# EAGLE board SparkFun_Main_Board_Double_v20 (EAGLE 9.6.2)
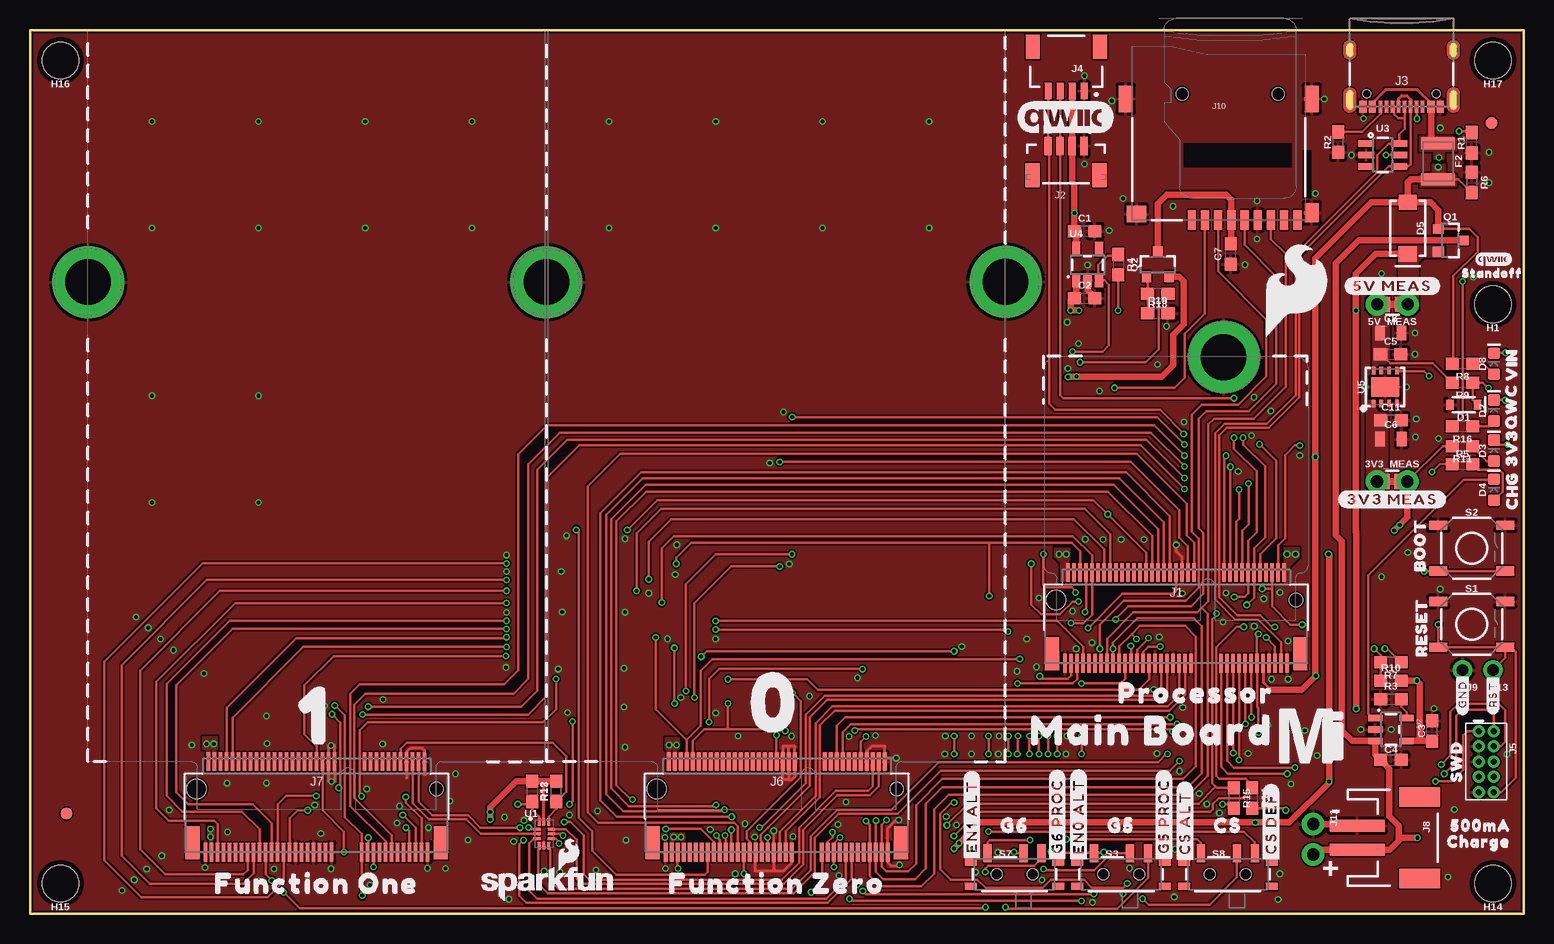
[diagram p1: board, top side]
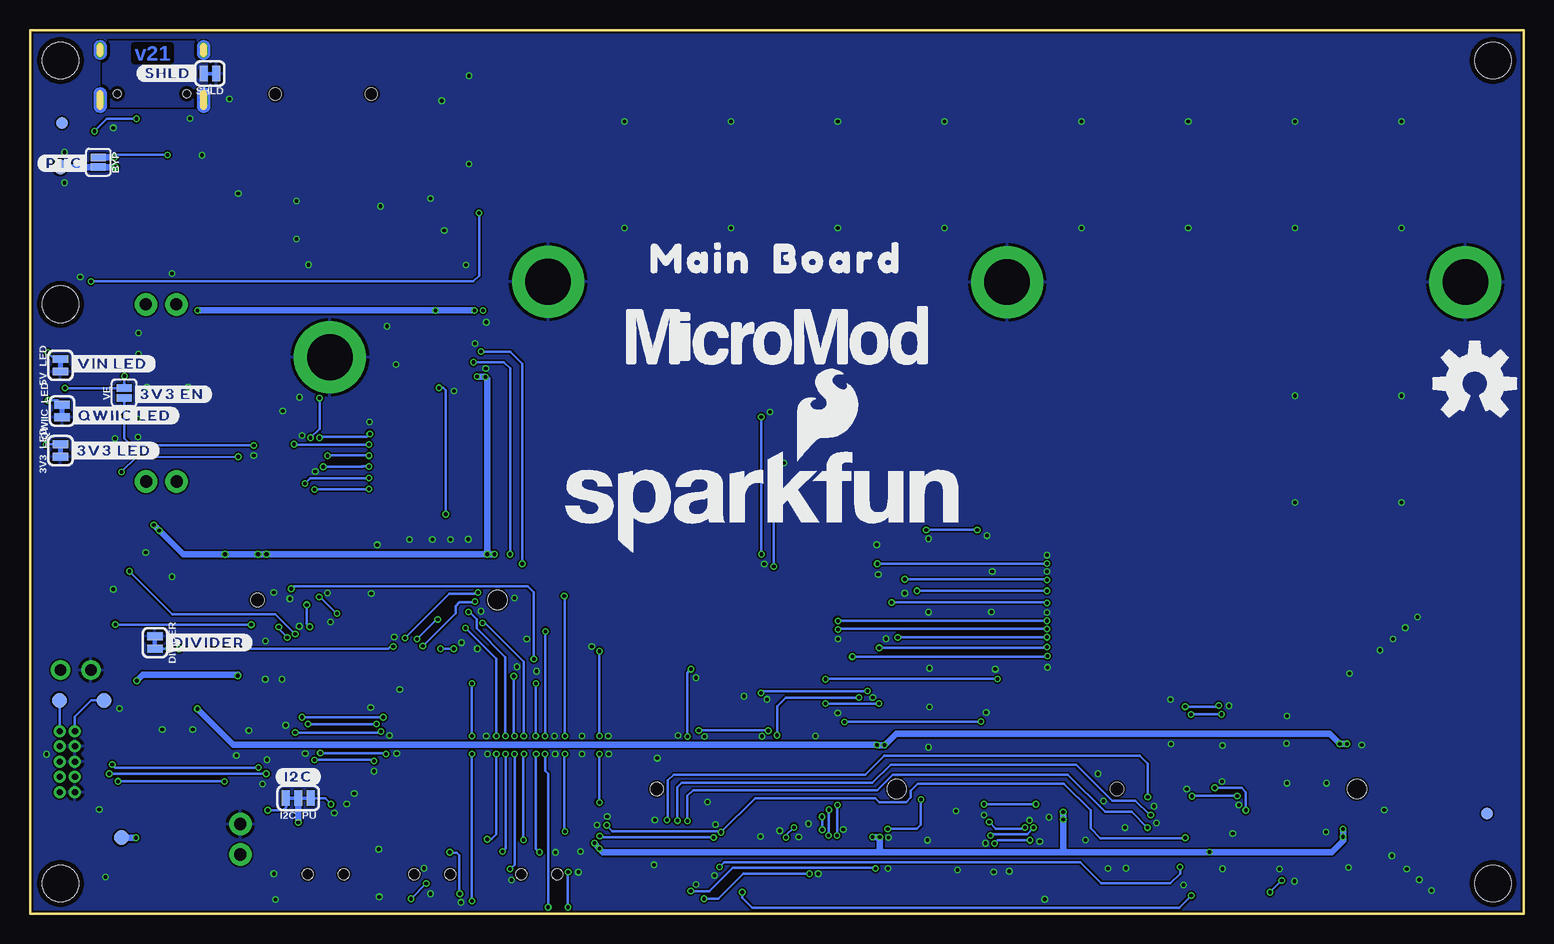
[diagram p2: board, bottom side, seen from below]

Size 124.46 x 73.66 mm. Coordinates in mm from the lower left corner, seen from the top.
Outline: 0,73.66 124.46,73.66 124.46,0 0,0 0,73.66
Copper layers (1*16): Top 0.035mm / dielectric 1.5mm / Bottom 0.035mm
Design rules "SparkFun-2-Layer-Minimum-JLCPCB": minimum track width 5mil, minimum drill 0.3mm, track to track 5mil, track to pad 5mil, pad to pad 5mil, via to via 5mil, smd to smd 5mil, copper to edge 7mil, drill to drill 7mil, minimum pad ring 5mil, minimum via ring 5mil, stop-mask expansion 2.5mil, vias tented up to drill 25mil, thermal gap 10mil
Net classes: 0 default: width 0.178 mm, drill 0.305 mm; 1 POWER: width 0.559 mm, drill 0.305 mm; 2 Diff pairs: width 0.203 mm, drill 0.305 mm
tRestrict: area 25.1,12.5 to 25.2,12.9; area 25.6,12.5 to 25.7,12.9; area 62.9,12.5 to 63,12.9; area 63.4,12.5 to 63.6,12.9

## Footprints (pad centres in the part's own frame; a part is rotated, then mirrored left to right if it is on the bottom)
SMT-JUMPER_2_NC_TRACE_SILK = smd 0.66 x 1.27: 1 -0.521,0; 2 0.521,0
COMBO-JUMPER_2_NC_TRACE = smd 0.635 x 1.27: 1 -0.508,0; 2 0.508,0 | drill 1.016 pad 1.88: 3 -1.27,0; 4 1.27,0
SMT-JUMPER_2_NO_SILK = smd 0.635 x 1.27: 1 -0.406,0; 2 0.406,0
0603 = smd 1.1 x 1: 1 -0.85,0; 2 0.85,0
0805 = smd 0.8 x 1.2: 1 -0.9,0; 2 0.9,0
SOD-323 = smd 0.63 x 0.83: A 1.15,0; C -1.15,0
LED-0603 = smd 1 x 1: A -0.877,0; C 0.877,0
SMA-DIODE = smd 1.27 x 1.47: A -2.15,0; C 2.15,0
1210 = smd 1 x 2.8: 1 -1.5,0; 2 1.5,0
FIDUCIAL-1X2 = smd 1 x 1: 1 0,0
STAND-OFF-TIGHT = hole 3.048: 0,0
STAND-OFF-REFLOW-M2.5 = drill 3.8 pad 6: 1 0,0
SMT-JUMPER_3_2-NC_TRACE_SILK = smd 0.66 x 1.27: 1 -1.041,0; 2 0,0; 3 1.041,0
M.2-CONNECTOR-E = smd 0.3 x 1.55: 1 9.25,-5.275; 2 9,2.275; 3 8.75,-5.275; 4 8.5,2.275; 5 8.25,-5.275; 6 8,2.275; 7 7.75,-5.275; 8 7.5,2.275; 9 7.25,-5.275; 10 7,2.275; 11 6.75,-5.275; 12 6.5,2.275; 13 6.25,-5.275; 14 6,2.275; 15 5.75,-5.275; 16 5.5,2.275; 17 5.25,-5.275; 18 5,2.275; 19 4.75,-5.275; 20 4.5,2.275; 21 4.25,-5.275; 22 4,2.275; 23 3.75,-5.275; 32 1.5,2.275; 33 1.25,-5.275; 34 1,2.275; 35 0.75,-5.275; 36 0.5,2.275; 37 0.25,-5.275; 38 0,2.275; 39 -0.25,-5.275; 40 -0.5,2.275; 41 -0.75,-5.275; 42 -1,2.275; 43 -1.25,-5.275; 44 -1.5,2.275; 45 -1.75,-5.275; 46 -2,2.275; 47 -2.25,-5.275; 48 -2.5,2.275; 49 -2.75,-5.275; 50 -3,2.275; 51 -3.25,-5.275; 52 -3.5,2.275; 53 -3.75,-5.275; 54 -4,2.275; 55 -4.25,-5.275; 56 -4.5,2.275; 57 -4.75,-5.275; 58 -5,2.275; 59 -5.25,-5.275; 60 -5.5,2.275; 61 -5.75,-5.275; 62 -6,2.275; 63 -6.25,-5.275; 64 -6.5,2.275; 65 -6.75,-5.275; 66 -7,2.275; 67 -7.25,-5.275; 68 -7.5,2.275; 69 -7.75,-5.275; 70 -8,2.275; 71 -8.25,-5.275; 72 -8.5,2.275; 73 -8.75,-5.275; 74 -9,2.275; 75 -9.25,-5.275 | smd 1.2 x 2.75: A1 10.35,-4.5; A2 -10.35,-4.5 | hole 1.1: 10,0 | hole 1.6: -10,0
JST04_1MM_VERT = smd 0.6 x 1.55: 1 -1.478,0.775; 2 -0.478,0.775; 3 0.522,0.775; 4 1.522,0.775 | smd 1.2 x 2: NC1 -2.778,3.2; NC2 2.822,3.2
USB-C-16P-2LAYER-PADS = smd 0.3 x 1: A5 -1.25,-0.34; A6 -0.25,-0.34; A7 0.25,-0.34; A8 1.25,-0.34; B5 1.75,-0.34; B6 0.75,-0.34; B7 -0.75,-0.34; B8 -1.75,-0.34 | smd 0.6 x 1: GND -3.225,-0.34; GND2 3.225,-0.34; VBUS1 -2.45,-0.34; VBUS2 2.45,-0.34 | drill 0.4 pad 0.6 long: SHLD1 -4.318,-0.915; SHLD2 4.318,-0.915; SHLD3 -4.318,-5.095; SHLD4 4.318,-5.095 | hole 0.65: -2.89,-1.445; 2.89,-1.445
JST04_1MM_RA = smd 0.6 x 1.35: 1 -1.5,0; 2 -0.5,0; 3 0.5,0; 4 1.5,0 | smd 1.2 x 2: NC1 2.8,-3.675; NC2 -2.8,-3.675
2X5-PTH-1.27MM = drill 0.508 pad 1: 1 -2.54,-0.635; 2 -2.54,0.635; 3 -1.27,-0.635; 4 -1.27,0.635; 5 0,-0.635; 6 0,0.635; 7 1.27,-0.635; 8 1.27,0.635; 9 2.54,-0.635; 10 2.54,0.635
M.2-CONNECTOR-E-FUNCTION-STANDARD = smd 0.3 x 1.55: 1 9.25,-5.275; 2 9,2.275; 3 8.75,-5.275; 4 8.5,2.275; 5 8.25,-5.275; 6 8,2.275; 7 7.75,-5.275; 8 7.5,2.275; 9 7.25,-5.275; 10 7,2.275; 11 6.75,-5.275; 12 6.5,2.275; 13 6.25,-5.275; 14 6,2.275; 15 5.75,-5.275; 16 5.5,2.275; 17 5.25,-5.275; 18 5,2.275; 19 4.75,-5.275; 20 4.5,2.275; 21 4.25,-5.275; 22 4,2.275; 23 3.75,-5.275; 32 1.5,2.275; 33 1.25,-5.275; 34 1,2.275; 35 0.75,-5.275; 36 0.5,2.275; 37 0.25,-5.275; 38 0,2.275; 39 -0.25,-5.275; 40 -0.5,2.275; 41 -0.75,-5.275; 42 -1,2.275; 43 -1.25,-5.275; 44 -1.5,2.275; 45 -1.75,-5.275; 46 -2,2.275; 47 -2.25,-5.275; 48 -2.5,2.275; 49 -2.75,-5.275; 50 -3,2.275; 51 -3.25,-5.275; 52 -3.5,2.275; 53 -3.75,-5.275; 54 -4,2.275; 55 -4.25,-5.275; 56 -4.5,2.275; 57 -4.75,-5.275; 58 -5,2.275; 59 -5.25,-5.275; 60 -5.5,2.275; 61 -5.75,-5.275; 62 -6,2.275; 63 -6.25,-5.275; 64 -6.5,2.275; 65 -6.75,-5.275; 66 -7,2.275; 67 -7.25,-5.275; 68 -7.5,2.275; 69 -7.75,-5.275; 70 -8,2.275; 71 -8.25,-5.275; 72 -8.5,2.275; 73 -8.75,-5.275; 74 -9,2.275; 75 -9.25,-5.275 | smd 1.2 x 2.75: A1 10.35,-4.5; A2 -10.35,-4.5 | hole 1.1: 10,0 | hole 1.6: -10,0
JST-2-SMD = smd 1 x 4.6: 1 -1,-3.7; 2 1,-3.7 | smd 1.6 x 3.4: NC1 -3.4,1.5; NC2 3.4,1.5
1X01_NO_SILK = drill 0.95 pad 1.6: 1 0,0
MICROSD-EXTERNALPIN = smd 0.7 x 1.6: 1 2.25,10.5; 2 1.15,10.5; 3 0.05,10.5; 4 -1.05,10.5; 5 -2.15,10.5; 6 -3.25,10.5; 7 -4.35,10.5; 8 -5.45,10.5; 9 -6.55,10.5 | smd 1.2 x 1.6: 10 -7.75,9.9 | smd 1.2 x 2.2: 11 -7.75,0.4; 12 7.75,0.4 | smd 1.6 x 1.4: 13 6.85,10 | hole 1: 3.05,0; -4.95,0
1X02_NO_SILK = drill 1.016 pad 1.88: 1 0,0; 2 2.54,0
SOT23-3 = smd 0.8 x 0.9: 1 -0.95,-1; 2 0.95,-1; 3 0,1.1
TACTILE_SWITCH_SMD_5.2MM = smd 1.524 x 0.762: 1 -2.794,1.905; 2 2.794,1.905; 3 -2.794,-1.905; 4 2.794,-1.905
SWITCH_SPST_SMD_A = smd 0.7 x 1.5: 1 -2.25,-1.75; 2 -0.75,-1.75; 3 2.25,-1.75 | smd 1 x 0.6: GND1 -3.65,1; GND3 3.65,1 | smd 1 x 0.8: GND2 -3.65,-1.1; GND4 3.65,-1.1 | hole 0.9: -1.5,0; 1.5,0
PAD.03X.05 = smd 1.27 x 1.27: 1 0,0
STG3856 = smd 0.6 x 0.25: P1 -0.59,0.41; P2 -0.59,0.01; P3 -0.59,-0.39; P7 0.58,-0.39; P8 0.58,0.01; P9 0.58,0.41 | smd 0.25 x 0.6: P4 -0.42,-0.96; P5 -0.02,-0.96; P6 0.38,-0.96; P10 0.38,1.01; P11 -0.02,1.01; P12 -0.42,1.01
SOT23-5 = smd 0.55 x 1.2: 1 -0.95,-1.3; 2 0,-1.3; 3 0.95,-1.3; 4 0.95,1.3; 5 -0.95,1.3
SOT-23-6 = smd 0.55 x 1.35: 1 -0.95,-1.375; 2 0,-1.375; 3 0.95,-1.375; 4 0.95,1.375; 5 0,1.375; 6 -0.95,1.375
SOT25 = smd 0.7 x 1.2: 1 -0.95,-1.3; 2 0,-1.3; 3 0.95,-1.3; 4 0.95,1.3; 5 -0.95,1.3
UDFN-8 = smd 0.3 x 0.65: 1 -0.975,-1.375; 2 -0.325,-1.375; 3 0.325,-1.375; 4 0.975,-1.375; 5 0.975,1.375; 6 0.325,1.375; 7 -0.325,1.375; 8 -0.975,1.375 | smd 2.35 x 1.6: EP 0,0

## Placement (x,y rotation side)
3V3_LED  JUMPER-SMT_2_NC_TRACE_SILK  [SMT-JUMPER_2_NC_TRACE_SILK]  121.92,38.61 90 bottom
3V3_MEAS  JUMPER-COMBO_2_NC_TRACE  [COMBO-JUMPER_2_NC_TRACE]  113.51,36.04 0 top
5V_LED  JUMPER-SMT_2_NC_TRACE_SILK  [SMT-JUMPER_2_NC_TRACE_SILK]  121.92,45.72 90 bottom
5V_MEAS  JUMPER-COMBO_2_NC_TRACE  [COMBO-JUMPER_2_NC_TRACE]  113.54,50.8 180 top
BYP  JUMPER-SMT_2_NO_SILK  [SMT-JUMPER_2_NO_SILK]  118.77,62.64 270 bottom
C1  1.0uF  [0603]  87.88,56.9 0 top
C2  1.0uF  [0603]  87.88,51.31 0 top
C3  4.7uF  [0603]  116.84,15.24 90 top
C4  4.7uF  [0603]  113.41,12.83 0 top
C5  0.1uF  [0603]  113.39,46.63 0 top
C6  10uF  [0805]  113.41,39.57 0 top
C7  10uF  [0603]  100.08,54.99 90 top
C8  10uF  [0805]  113.39,48.41 0 top
C11  4.7uF  [0603]  113.41,41.15 0 top
D1  3.3V  [SOD-323]  119.48,42.44 180 top
D2  RED  [LED-0603]  121.99,41.95 90 top
D3  RED  [LED-0603]  121.99,38.6 90 top
D4  Yellow  [LED-0603]  121.99,35.35 90 top
D5  3A/40V/500mV  [SMA-DIODE]  114.81,57.15 270 top
D8  RED  [LED-0603]  121.99,45.85 90 top
DIVIDER  JUMPER-SMT_2_NC_TRACE_SILK  [SMT-JUMPER_2_NC_TRACE_SILK]  114.05,22.61 270 bottom
F2  6V/2A  [1210]  117.35,62.74 270 top
FD1  FIDUCIAL1X2  [FIDUCIAL-1X2]  3.05,8.38 180 bottom
FD2  FIDUCIAL1X2  [FIDUCIAL-1X2]  3.05,8.38 180 top
FD3  FIDUCIAL1X2  [FIDUCIAL-1X2]  121.79,65.91 270 top
FD4  FIDUCIAL1X2  [FIDUCIAL-1X2]  121.79,65.91 90 bottom
FRAME1  FRAME-LEDGER  [CREATIVE_COMMONS]  36.83,-24.13 0 top  (outside the outline)
FRAME2  FRAME-LEDGERNO_FOOTPRINT  [DUMMY]  36.83,-24.13 0 top  (outside the outline)
H1  STAND-OFFTIGHT  [STAND-OFF-TIGHT]  121.92,50.8 180 top
H2  STAND-OFF-REFLOW-M2.5_2.5MM_TALL  [STAND-OFF-REFLOW-M2.5]  43.04,52.65 180 top
H3  STAND-OFF-REFLOW-M2.5_2.5MM_TALL  [STAND-OFF-REFLOW-M2.5]  4.84,52.65 90 top
H4  STAND-OFF-REFLOW-M2.5_2.5MM_TALL  [STAND-OFF-REFLOW-M2.5]  81.29,52.68 90 top
H8  STAND-OFF-REFLOW-M2.5_2.5MM_TALL  [STAND-OFF-REFLOW-M2.5]  99.46,46.39 90 top
H14  STAND-OFFTIGHT  [STAND-OFF-TIGHT]  121.92,2.54 180 top
H15  STAND-OFFTIGHT  [STAND-OFF-TIGHT]  2.54,2.54 180 top
H16  STAND-OFFTIGHT  [STAND-OFF-TIGHT]  2.54,71.12 180 top
H17  STAND-OFFTIGHT  [STAND-OFF-TIGHT]  121.92,71.12 180 top
I2C_PU  JUMPER-SMT_3_2-NC_TRACE_SILK  [SMT-JUMPER_3_2-NC_TRACE_SILK]  102.11,9.65 180 bottom
J1  MICROMOD-2222-C  [M.2-CONNECTOR-E]  95.5,26.16 0 top
J2  Vertical Qwiic Connector  [JST04_1MM_VERT]  86.36,64.77 180 top
J3  [USB-C-16P-2LAYER-PADS]  114.3,66.9 180 top
J4  QWIIC_RIGHT_ANGLE  [JST04_1MM_RA]  86.36,68.58 180 top
J5  CORTEX_JTAG_DEBUG_MINIMUM_PTH  [2X5-PTH-1.27MM]  121.35,12.69 270 top
J6  MICROMOD_FUNCTION_MAIN  [M.2-CONNECTOR-E-FUNCTION-STANDARD]  62.23,10.41 0 top
J7  MICROMOD_FUNCTION_MAIN  [M.2-CONNECTOR-E-FUNCTION-STANDARD]  23.88,10.41 0 top
J8  [JST-2-SMD]  114.3,6.35 270 top
J9  [1X01_NO_SILK]  119.38,20.32 180 top
J10  MICRO-SD-PUSH-PUSH-EXT-PIN  [MICROSD-EXTERNALPIN]  99.06,68.33 180 top
J11  [1X02_NO_SILK]  106.93,7.49 270 top
J13  [1X01_NO_SILK]  121.92,20.32 180 top
LOGO1  QWIIC_LOGO_8MM  [QWIIC_8MM]  86.31,66.37 0 top
LOGO2  SFE_LOGO_NAME_FLAME.3_INCH  [SFE_LOGO_NAME_FLAME_.3]  63.5,34.29 0 bottom
LOGO3  OSHW-LOGOL  [OSHW-LOGO-L]  4.06,44.2 0 bottom
Q1  3.1A/30V/105mΩ  [SOT23-3]  118.36,56.13 270 top
Q2  20V/4.2A/52mΩ/1.4W  [SOT23-3]  93.98,54.1 0 top
QWIIC_LED  JUMPER-SMT_2_NC_TRACE_SILK  [SMT-JUMPER_2_NC_TRACE_SILK]  121.79,41.91 90 bottom
R1  5.1k  [0603]  120.14,64.26 90 top
R2  5.1k  [0603]  109.02,64.31 90 top
R3  2.0k  [0603]  113.41,17.91 0 top
R4  100k  [0603]  90.68,54.1 270 top
R5  4.7k  [0603]  119.38,37.47 0 top
R6  10k  [0603]  120.14,60.96 270 top
R7  10k  [0603]  113.41,20.95 180 top
R8  2.2k  [0603]  119.38,45.85 180 top
R9  100k  [0603]  119.38,44.28 180 top
R10  20k  [0603]  113.41,19.43 0 top
R11  1k  [0603]  119.38,38.99 180 top
R12  100k  [0603]  43.87,10.21 90 top
R13  100k  [0603]  41.83,10.21 270 top
R14  2.2k  [0603]  101.85,9.65 270 top
R15  2.2k  [0603]  100.33,9.65 270 top
R16  1k  [0603]  119.38,40.62 180 top
R18  100  [0603]  93.98,51.67 180 top
R19  100k  [0603]  93.97,50.04 0 top
S1  Reset  [TACTILE_SWITCH_SMD_5.2MM]  120.14,24.13 0 top
S2  BOOT  [TACTILE_SWITCH_SMD_5.2MM]  120.14,30.48 0 top
S3  [SWITCH_SPST_SMD_A]  90.93,3.3 180 top
S7  [SWITCH_SPST_SMD_A]  82.04,3.3 180 top
S8  [SWITCH_SPST_SMD_A]  99.82,3.3 180 top
SHLD  JUMPER-SMT_2_NC_TRACE_SILK  [SMT-JUMPER_2_NC_TRACE_SILK]  109.47,70.03 180 bottom
TP1  TEST-POINT3X5  [PAD.03X.05]  122.02,17.8 180 bottom
TP2  TEST-POINT3X5  [PAD.03X.05]  118.29,17.79 0 bottom
TP3  TEST-POINT3X5  [PAD.03X.05]  116.84,6.35 90 bottom
TP4  TEST-POINT3X5  [PAD.03X.05]  121.92,62.23 180 bottom
U1  STG3856QTR  [STG3856]  42.85,6.65 0 top
U2  MCP73831  [SOT23-5]  113.41,15.37 270 top
U3  ESD Diode  [SOT-23-6]  112.73,63.25 270 top
U4  AP7347DQ-33W5-7K-3.3V  [SOT25]  88.14,54.1 0 top
U5  AP7361C-33  [UDFN-8]  112.93,43.92 0 top
U$1  [#3V3_LED#22]  117.47,38.61 0 bottom
U$2  [#3V3_EN#23]  112.65,43.31 0 bottom
U$3  [#PTC#503]  121.62,62.56 0 bottom
U$4  [3V332533]  123.48,38.84 90 top
U$5  [VIN32532]  123.47,45.77 90 top
U$6  [CHG32531]  123.51,35.26 90 top
U$7  [#SHLD#501]  112.98,70.05 0 bottom
U$8  [BOOT32541]  115.82,30.73 90 top
U$9  [RESET32540]  115.95,23.88 90 top
U$10  [PROCESSOR525]  97.16,18.41 0 top
U$11  [FUNCTION_ZERO520]  62.23,2.54 0 top
U$12  [FUNCTION_ONE524]  23.88,2.54 0 top
U$13  [MAIN523]  68.58,54.61 0 bottom
U$14  [MICROMOD_MI_LOGO_1]  106.81,14.86 0 top
U$15  [0523]  62.23,17.53 0 top
U$16  [1524]  23.88,16.51 0 top
U$17  [MICROMOD_LOGO_1]  62.23,48.26 0 bottom
U$18  [BOARD524]  57.15,54.61 0 bottom
U$19  [G518]  90.93,7.37 0 top
U$20  [#CS_ALT#20]  96.24,7.59 90 top
U$21  [MAIN_BOARD5523]  93.47,15.27 0 top
U$22  [QWIIC_3MM]  121.97,54.56 0 top
U$23  [STANDOFF501]  121.84,53.39 0 top
U$24  [SFE_LOGO_FLAME_.3]  105.59,51.92 0 top
U$25  [SWD6522]  118.87,12.7 90 top
U$26  [#3V3_MEAS#6522]  113.51,34.54 0 top
U$27  [CHARGE501]  120.73,6.02 0 top
U$28  [#QWIIC_LED#22]  116.59,41.53 0 bottom
U$29  [G6519]  82.04,7.37 0 top
U$30  [#I2C#501]  102.11,11.43 0 bottom
U$31  [#5V_MEAS#6522]  113.54,52.32 0 top
U$32  [CS17]  99.82,7.37 0 top
U$33  [500MA6520]  120.9,7.37 0 top
U$34  [#CS_DEF#19]  103.43,7.52 90 top
U$35  [#G5_PROC#21]  94.49,8.13 90 top
U$36  [#G6_PROC#21]  85.6,8.13 90 top
U$37  [#EN0_ALT#21]  87.38,8.13 90 top
U$38  [#EN1_ALT#21]  78.49,8.13 90 top
U$39  [#RST#6521]  121.92,18.29 90 top
U$40  [#GND#6520]  119.38,18.29 90 top
U$41  [#DIVIDER#23]  109.6,22.61 0 bottom
U$42  [#VIN_LED#24]  117.6,45.85 0 bottom
U$43  [QWC18]  123.44,42.29 90 top
U$44  [SFE_LOGO_NAME_FLAME_.1]  43.18,2.54 0 top
VE  JUMPER-SMT_2_NO_SILK  [SMT-JUMPER_2_NO_SILK]  116.61,43.41 90 bottom

## Tracks (layer width: path | path; a pad name or v marks a point on that pad's centre or on a via)
3.3V  (via drill 0.3, 0.35)
  Top 0.203: v117.12,11.05 118.49,11.05 119.46,12.01 119.46,14.88 119.81,15.23 J5.1 | J7.36 24.38,8.64 26.16,6.86 v26.16,5.16 | 3V3_MEAS.4 117.73,38.99 R11.2
  Top 0.254: U1.P11 42.83,11.06
  Top 0.559: v108.2,29.97 108.25,29.92 v108.25,11.02 108.25,10.95 104.93,7.62 v102.11,7.62 79.16,7.62 77.01,5.47 v77.01,5.44 | v38.35,7.87 38.35,8.89 40.52,11.06 R13.1 42.83,11.06 R12.2 | v113.69,31.95 114.78,33.05 3V3_MEAS.4 3V3_MEAS.2 | v86.51,44.75 86.54,44.78 94.31,44.78 95.25,45.72 95.25,48.26 96.14,49.15 96.14,52.72 95.76,53.1 Q2.2
  Bottom 0.203: v117.12,11.05 108.28,11.05 v108.25,11.02 | TP2.1 119.37,17.79 120.71,16.45 J5.1
  Bottom 0.559: v86.36,29.97 86.36,44.6 v86.51,44.75 86.54,44.77 v87.2,44.77 | v86.36,29.97 v104.75,29.97 v108.2,29.97 111.71,29.97 v113.69,31.95 v114.15,32.41 | 53.7,5.16 38.35,5.16 | 38.35,5.16 v26.16,5.16 15.98,5.16 15.04,6.1 v15.04,6.43 v15.04,7.09 | 38.35,5.16 v38.35,7.87 v38.35,8.48 | 53.7,5.16 53.65,5.21 v53.65,6.4 v54.25,6.4 | I2C_PU.2 v102.11,7.62 | 53.7,5.16 76.73,5.16 v77.01,5.44 77.42,5.84 v77.42,5.9 | v86.36,29.97 v85.75,29.97
  other vias: 105.46,29.97
  pour Top (isolate 0.305, no thermals): 85.94,29.25 85.95,29.21 85.95,27.74 86.59,27.74 86.59,30.45 85.42,30.45 85.42,29.77
  pour Top (isolate 0.305, no thermals): 104.39,27.69 104.9,27.69 104.9,28.93 104.92,28.97 105.71,29.77 105.71,30.48 104.39,30.48
  pour Top (no thermals): 53.65,6.14 53.67,6.15 54.56,6.15 54.56,6.71 53.34,6.71 53.34,4.6 53.62,4.6 53.62,6.1 53.63,6.12
  pour Top (no thermals): 14.98,6.27 14.99,6.25 14.99,4.85 15.24,4.85 15.24,6.25 15.25,6.27 15.27,6.29 15.29,6.3 15.37,6.3 15.37,7.29 14.81,7.29 14.81,6.3 14.94,6.3 14.96,6.29
3.3V_EN  (via drill 0.3)
  Top 0.203: J1.4 104,30.73 104.58,31.3 104.58,38.21 105.41,39.04 v105.82,39.04
  Bottom 0.203: VE.1 116.61,39.65 116,39.04 v105.82,39.04
3.3V_EN_VE  (via drill 0.3)
  Top 0.203: U5.5 113.98,45.21 116.2,45.21 v116.59,44.83 | D1.C 120.23,42.84 R9.1 121.07,44.28 v121.54,43.81
  Bottom 0.203: v116.59,44.83 116.61,44.81 VE.2 v121.54,43.81
3.3V_QWIIC  (via drill 0.3)
  Top 0.203: R16.2 119.38,41.47 v119.38,52.7
  Top 0.559: J4.2 86.86,64.02 J2.2 86.84,60.99 87.03,60.79 v87.03,58.42 C1.1 87.19,56.74 U4.5
  Bottom 0.203: v119.38,52.7 87.5,52.7 87.03,53.17 v87.03,58.42
3V3_MEAS
  pour Top (no thermals): 111.38,42.8 111.38,35.69 111.89,35.18 112.65,35.18 113.16,35.69 113.16,41.53 112.9,41.78 112.39,41.78 112.14,42.04 112.14,42.8
5V_MEAS
  Top 0.203: C5.1 112.61,46.63 113.34,45.91 116.91,45.91 R9.2
  pour Top (no thermals): 111.89,44.96 111.89,49.91 111.38,50.42 111.38,51.18 111.89,51.69 112.78,51.69 113.28,51.18 113.28,46.23 112.9,45.85 112.39,45.85 112.14,45.59 112.14,44.96
!BOOT!  (via drill 0.3)
  Top 0.203: S2.4 S2.3 117.32,28.55 v116.18,28.55 | v102.36,23.32 102.23,23.19 102.23,20.91 J1.11 102.25,17.26 102.36,17.15 v102.36,15.11 | v95.22,15.21 95.06,15.38 68.82,15.38 v68.73,15.29 | v62.94,15.27 62.81,15.39 58.17,15.39 | J6.66 55.23,14.44 56.19,15.39 58.17,15.39 | J7.66 16.88,16.34 22.78,22.25 v39.71,22.25 | v53.7,22.17 53.7,17.55 v53.72,17.53 | v58.17,17.53 58.17,15.39
  Bottom 0.203: v102.36,23.32 104.01,24.97 112.6,24.97 v116.18,28.55 | v102.36,15.11 95.38,15.11 95.25,15.24 v95.22,15.21 | v62.94,15.27 62.94,15.29 62.97,15.32 68.71,15.32 v68.73,15.29 | v53.72,17.53 v58.17,17.53 | v39.71,22.25 39.92,22.25 40,22.17 v53.7,22.17
!CS0!-PROCESSOR  (via drill 0.3)
  Top 0.203: J6.49 59.49,3.38 v59.51,3.35 | J1.55 91.25,19.62 90.84,19.2 v87.63,19.2 | v87.63,14.83 v87.63,13.34 | v87.63,1.09 87.61,1.11 68.46,1.11 v68.3,1.27
  Bottom 0.203: v59.51,3.35 65.02,3.35 67.11,1.27 v68.3,1.27 | v87.63,19.2 v87.63,14.83 | v87.63,13.34 v87.63,1.09
!CS1!-PROC-JUMPER  (via drill 0.3)
  Top 0.203: S8.2 100.57,3.04 98.3,0.76 93.22,0.76 v92.71,1.27 | v91.44,2.54 91.08,2.18 88.49,2.18 87.85,2.83 85.07,2.83 84.4,2.16 79.63,2.16 78.96,2.83 76.72,2.83 75.84,3.71 75.84,8.33 76.81,9.3 v77.01,9.3 | v77.01,13.34 v77.01,14.83 | v77.01,21.89 56.39,21.89 v55.93,21.44 | v39.67,21.49 25.3,21.49 22.86,19.05 22.86,14.99 23.88,13.97 J7.38
  Bottom 0.203: v92.71,1.27 v91.44,2.54 | v77.01,9.3 v77.01,13.34 | v77.01,14.83 v77.01,21.89 | v55.93,21.44 39.73,21.44 v39.67,21.49
!CS1!-PROCESSOR  (via drill 0.3)
  Top 0.203: J1.70 87.5,30.23 86.79,30.94 79.93,30.94 | 79.93,30.94 55.12,30.94 53.85,29.67 v53.85,29.18 | J7.49 21.13,2.71 19.81,1.4 9.27,1.4 6.2,4.47 6.2,21 14.4,29.21 v39.71,29.21 | v79.88,13.34 v79.88,14.83 | v79.93,26.49 79.93,30.94 | S8.1 102.07,5.95 101.16,6.87 v79.89,6.87
  Bottom 0.203: v53.85,29.18 39.74,29.18 v39.71,29.21 | v79.88,13.34 79.92,13.3 79.92,6.71 79.89,6.74 v79.89,6.87 | v79.88,14.83 79.88,26.44 v79.93,26.49
!DFU-FC0!  (via drill 0.3)
  Top 0.203: U1.P12 42.43,8.11 41.83,8.71 R13.2 41.62,9.14 v40.64,9.14 | v69.37,20.4 69.32,20.45 57.45,20.45 56.59,19.58 v56.59,16 | v45.21,16.03 45.21,9.4 v44.96,9.14 | v69.67,14.8 69.23,14.35 J6.10
  Bottom 0.203: v69.37,20.4 69.67,20.09 v69.67,14.8 | v56.59,16 56.57,16.03 v45.21,16.03 | v40.64,9.14 v44.96,9.14
!DFU-FC1!
  Top 0.203: U1.P10 43.23,8.11 43.87,8.75 R12.1 44.7,10.2 44.7,13.13 43.56,14.28 31.39,14.28 30.88,13.76 J7.10
!RESET!  (via drill 0.3)
  Top 0.203: v106.02,24.11 105.03,24.11 103.5,25.63 103.5,27.1 | J1.6 103.5,27.1 | v117.35,24.13 S1.3 S1.4 | J5.10 122.62,10.15 123.83,11.36 123.83,21.84 123.44,22.23 S1.4 | v102.69,27.1 103.5,27.1 | v82.47,21.23 56.87,21.23 55.9,20.26 55.9,15.7 54.73,14.53 | 54.73,14.53 54.71,14.51 52.15,17.07 v52.15,23.04 | 54.73,14.53 J6.68 | J7.68 16.38,17.16 22.2,22.99 39.64,22.99 v39.71,23.06 | J13.1 122.94,21.34 S1.4
  Bottom 0.203: v106.02,24.11 117.32,24.11 v117.35,24.13 | v102.69,27.1 102.49,27.3 82.96,27.3 82.47,26.82 v82.47,21.23 | v39.71,23.06 39.74,23.04 v52.15,23.04
A0-PROCESSOR  (via drill 0.3)
  Top 0.203: J1.34 96.48,28.46 96.48,30.64 95.75,31.36 95.75,33.64 91.72,37.67 v62.48,37.67 | v62.48,28.96 58.42,28.96 55.37,25.91 v55.37,18.03 | J6.38 62.2,12.71 v62.2,14.88
  Bottom 0.203: v62.48,37.67 v62.48,28.96 | v55.37,18.03 61.47,18.03 62.2,17.3 v62.2,14.88
A1-PROCESSOR/!CS1!-ALT  (via drill 0.3)
  Top 0.203: J1.38 95.5,26.95 95.24,26.68 91.03,26.68 v88.17,23.82 | v85.6,14.83 v85.6,13.34 | S8.3 97.57,5.94 97.29,6.22 v86.36,6.22
  Bottom 0.203: v88.17,23.82 85.61,21.26 85.61,14.84 v85.6,14.83 | v85.6,13.34 85.6,6.66 86.03,6.22 v86.36,6.22
CTS1-PROCESSOR  (via drill 0.3)
  Top 0.203: J1.15 101.25,15.87 v101.3,15.82 | v95.58,15.82 68.4,15.82 67.73,15.15 J6.16
  Bottom 0.203: v95.58,15.82 v101.3,15.82
D0-PROCESSOR  (via drill 0.3)
  Top 0.203: J1.10 102.5,29.99 103.83,31.32 103.83,37.77 v102.46,39.14 | v63.52,41.4 93.93,41.4 v96.22,39.12 | 54.66,18.82 54.66,27.48 57.15,29.97 v63.5,29.97 | v63.55,18.41 64.24,17.73 64.24,11.38 59.74,6.88 59.74,6.27 59.98,6.04 J6.47 | v54.66,18.57 54.66,18.82 | 54.66,18.82
  Bottom 0.203: v63.52,41.4 63.52,30 v63.5,29.97 | v54.66,18.57 63.4,18.57 v63.55,18.41 | v102.46,39.14 102.44,39.12 v96.22,39.12
D1-PROCESSOR  (via drill 0.3)
  Top 0.203: J1.18 100.5,32.69 100.76,32.94 v100.76,35.36 | v23.14,8.64 22.3,8.64 21.63,7.96 J7.47 | v27.71,16.61 41.5,16.61 42.98,18.09 42.98,36.25 45.77,39.04 92.58,39.04 v96.22,35.41 | v25.73,10.52 25.86,10.64 25.86,15.95 v25.17,16.64
  Bottom 0.203: v25.73,10.52 23.5,10.52 23.14,10.16 v23.14,8.64 | v25.17,16.64 27.69,16.64 v27.71,16.61 | v100.76,35.36 100.71,35.41 v96.22,35.41
D+
  Top 0.203: J1.3 104.25,22.64 102.36,24.54 100.44,24.54 98.75,26.22 98.75,40.05 99.54,40.84 103.07,40.84 105.46,43.23 105.46,55 112.25,61.79 112.25,63.23 113.22,64.2 U3.6 114.1,64.96 114.55,65.41 114.55,66.29 | J3.B6 113.67,67.12 113.67,66.65 114.03,66.29 114.55,66.29 | 114.55,66.29 J3.A6
D-  (via drill 0.3)
  Top 0.203: v103.73,23.9 103.5,23.9 102.51,24.89 100.58,24.89 99.08,26.39 99.08,39.88 99.72,40.51 103.25,40.51 105.79,43.06 105.79,54.86 113.22,62.3 U3.4 114.87,62.3 115.05,62.47 J3.B7 | v103.02,23.04 103.73,22.33 103.73,20.91 J1.5
  Top 0.254: J3.B7 115.08,67.28 115.08,67.85 114.73,68.2 114.3,68.2 114.05,67.94 J3.A7
  Bottom 0.203: v103.02,23.04 103.73,23.75 v103.73,23.9
G0-PROCESSOR  (via drill 0.3)
  Top 0.203: v58.47,8.1 48.9,8.1 47.53,9.47 47.53,33.39 50.94,36.8 91.35,36.8 95,33.16 J1.40 | J6.53 58.45,5.17 v58.45,7.01
  Bottom 0.203: v58.47,8.1 58.45,8.08 v58.45,7.01
G1-PROCESSOR  (via drill 0.3)
  Top 0.203: v57.89,8.69 57.76,8.56 49.43,8.56 48.03,9.96 48.03,33.26 51.07,36.3 90.79,36.3 94.46,32.63 94.46,28.48 J1.42 | v57.91,6.53 57.98,6.46 J6.55
  Bottom 0.203: v57.91,6.53 57.89,6.55 v57.89,8.69
G2-PROCESSOR  (via drill 0.3)
  Top 0.203: v57.17,9.07 57.1,8.99 49.91,8.99 48.43,10.47 48.43,32.88 51.3,35.75 90.31,35.75 94,32.05 J1.44 | v57.2,6.53 57.2,6.45 57.48,6.17 J6.57
  Bottom 0.203: v57.2,6.53 57.2,9.04 v57.17,9.07
G3-PROCESSOR  (via drill 0.3)
  Top 0.203: J1.46 93.5,31.51 89.82,35.2 51.35,35.2 48.87,32.71 48.87,10.74 50.09,9.53 v50.22,9.53 | v52.98,7.09 55.91,7.09 56.98,6.01 J6.59
  Bottom 0.203: v50.22,9.53 50.22,7.44 50.57,7.09 v52.98,7.09
G4-PROCESSOR/SD_CARD_!CS!  (via drill 0.3)
  Top 0.203: v49.77,31.99 52.27,34.49 88.62,34.49 v89.81,33.3 93,30.11 J1.48 | v45.52,32 45.72,31.8 45.72,8.03 46.84,6.91 46.84,5.28 48.84,3.28 56.24,3.28 56.48,3.52 J6.61 | J10.2 97.91,50.03 96.23,48.36 96.23,44.67 95.4,43.84 v90.37,43.84
  Bottom 0.203: v45.52,32 49.76,32 v49.77,31.99 | v90.37,43.84 90.02,43.84 89.81,43.64 v89.81,33.3
G5-JUMPER  (via drill 0.3)
  Top 0.203: v84.15,19.81 84.35,19.61 86.46,19.61 86.75,19.9 J1.73 | v84.07,14.83 v84.07,13.34 | v84.45,3.73 84.53,3.65 88.7,3.65 90.11,5.05 S3.2
  Bottom 0.203: v84.15,19.81 84.15,14.91 v84.07,14.83 | v84.07,13.34 84.07,4.11 v84.45,3.73
G5-PROCESSOR  (via drill 0.3)
  Top 0.203: v81.53,13.34 v81.53,14.83 | v81.51,23.55 81.36,23.7 v57.14,23.7 | J7.53 20.13,7.56 18.54,9.14 13.21,9.14 12.19,10.16 12.19,19.05 16.89,23.75 v39.71,23.75 | S3.1 93.18,3.01 90.6,0.43 81.41,0.43 v81.28,0.56
  Bottom 0.203: v81.53,14.83 81.51,14.86 v81.51,23.55 | v81.53,13.34 81.53,11.95 81.28,11.7 v81.28,0.56 | v39.71,23.75 56.91,23.75 56.93,23.74 57.1,23.74 v57.14,23.7
G6-JUMPER  (via drill 0.3)
  Top 0.203: v82.27,13.34 82.32,13.39 v82.32,14.83 | J1.71 87.25,19.56 86.9,19.2 v82.3,19.2 | S7.2 82.09,5.05 v82,5.14
  Bottom 0.203: v82.32,14.83 82.3,14.86 v82.3,19.2 | v82.27,13.34 82.3,13.31 82.3,5.44 v82,5.14
G6-PROCESSOR  (via drill 0.3)
  Top 0.203: v20.14,2.79 19.63,3.31 J7.55 | v21.13,1.8 22.46,0.47 79.54,0.47 v79.63,0.56 | v79.61,3.49 79.61,3.78 79.86,4.03 83.67,4.03 84.29,4.66 S7.1
  Bottom 0.203: v20.14,2.79 v21.13,1.8 | v79.63,0.56 79.63,3.47 v79.61,3.49
G7-PROCESSOR  (via drill 0.3)
  Top 0.203: J1.69 87.75,22.26 85.59,24.42 v57.14,24.42 | J7.57 19.13,7.04 17.63,8.53 12.68,8.53 11.38,9.83 11.38,19.18 16.64,24.43 v39.71,24.43
  Bottom 0.203: v39.71,24.43 57.12,24.43 v57.14,24.42
GND  (via drill 0.3)
  Top 0.203: J6.39 v61.98,6.93
  Top 0.254: 63.23,11.18 J6.34 63.23,13.93 arc-45 63.25,13.97 | 63.23,11.18 62.73,11.18 J6.36 62.73,13.95 arc-45 62.74,13.97 63.25,13.97 | 63.23,11.18 63.48,11.18 63.73,11.43 J6.32 63.73,13.97 63.25,13.97 | J6.2 71.23,12.95 | 71.23,12.95 71.23,13.97 70.13,13.97 69.73,13.57 J6.8 | v72.19,12.98 72.16,12.95 71.23,12.95 | 31.38,11.31 J7.8 31.38,13.49 31.7,13.82 32.66,13.82 32.88,13.61 J7.2 32.88,11.57 | v72.47,4.09 72.39,4.01 71.75,4.01 71.48,4.29 J6.1 71.48,7.14 72.17,7.83 v72.39,7.83 | J1.36 96,29.73 95.5,30.23 95.5,30.74 v95.52,30.76 | J6.39 61.98,3.56 | 61.98,3.56 60.45,3.56 60.45,5.11 J6.45 | J6.33 63.48,4.27 62.77,3.56 61.98,3.56 | J7.32 25.38,14.05 v25.09,14.05 24.88,14.05 J7.34 24.88,11.02 v25.12,11.02 25.38,11.02 J7.32
  Top 0.559: U4.2 88.15,52.79 88.15,51.99 88.73,51.41 C2.2 | J8.1 110.46,7.49 J11.1
  other vias: 116.99,17.12 120.27,53.09 118.69,8.71 14.58,3.86 102.26,56.24 102.26,59.41 101.52,13.36 103.15,15.72 105.08,10.82 94.11,23.09 88.49,22.61 114.81,30.12 23.72,9.07 30.58,7.57 33.12,3.81 33.2,7.19 49.66,6.15 93.65,18.69 102.02,23.97 104.7,12.85 118.16,3.07 80.75,14.83 80.7,13.34 83.06,22.91 93.9,13.36 86.88,25.22 104.85,19.56 103.45,19.56 94.51,14.87 42.85,3.56 47.29,8.59 59.59,7.52 28.07,10.41 96.06,17.2 117.53,27.05 57.15,16.74 63.46,14.81 87.18,22.09 52.91,6.38 25.1,3.76 95.78,11.89 67.34,7.44 35.46,11.68 35,9.4 63.58,6.45 60.4,6.4 39.55,8.05 82.25,20.22 83.87,20.6 57.14,22.91 53.14,22.94 51.56,26.72 53.77,28.3 49.58,31.27 44.7,31.52 39.71,28.52 39.71,25.12 44.02,20.4 44.78,16.79 54.23,18.03 40.31,6.05 44.83,5.89 41.17,7.8 44.96,8.26 44.15,3.51 52.96,3.78 39.9,1.22 28.35,2.41 20.35,3.73 9.73,3.73 8.69,2.84 10.97,4.85 11.96,21.97 10.87,22.91 9.86,23.85 68.96,19.68 63.04,17.88 68.25,14.78 70.46,14.86 68,9.32 67.41,3.2 68.96,2.46 58.78,3.35 56.69,7.04 77.22,7.42 95.35,1.42 86.33,13.34 86.44,14.83 30.78,8.97 63.27,29.16 61.65,37.57 62.79,41.83 104.15,26.79 102.81,26.26 49.58,25.15 49.5,20.47 49.5,17.25 49.58,13.89 44.35,25.17 44.27,28.52 87.93,31.22 89.41,31.19 107.11,60.05 91.08,59.61 90.14,67.77 107.85,67.92 29.39,14.15 19.76,14.2 19.71,16.48 59,14.83 106.22,15.29 107.26,13.21 34.62,3.78 24.23,6.71 16.46,6.83 36.5,6.17 111.28,43.92 123.09,13.31 14.5,20.04 13.49,14.07 16.41,10.9 19.71,10.9 19.08,2.72 7.67,1.96 8.84,24.74 87.88,62.48 87.88,69.85 98.07,9.16 99.11,8.41 97.43,10.05 64.95,18.14 111.12,66.29 117.53,65.51 24.54,17.35 29.41,17.86 121.59,60.93 121.59,63.47 114.71,43.92 112.62,53.37 115.42,46.63 115.42,48.41 88.14,54.08 89.94,56.95 74.93,66.04 47.17,3.66 110.13,63.22 66.04,66.04 66.04,57.15 74.93,57.15 57.15,66.04 57.15,57.15 48.26,57.15 48.26,66.04 36.83,66.04 36.83,57.15 27.94,57.15 27.94,66.04 19.05,66.04 19.05,57.15 10.16,57.15 10.16,66.04 104.01,1.19 115.51,41.25 104.83,22.73 115.47,39.75 117.37,39.62 87.38,47.55 84.07,26.34 101.24,54.1 78.59,5.21 39.71,29.9 84.34,2.82 76.36,8.12 95.4,5.38 104.14,3.35 88.54,0.97 80.67,5.13 39.67,20.55 77.65,22.28 76.28,14.83 78.46,14.83 78.46,13.34 76.23,13.34 89.13,43.58 93.95,45.8 86.44,49.3 86.49,45.46 96.16,40.99 101.8,39.88 100.69,36.88 105.82,38.2 102.01,43.05 103.4,41.91 11.61,8.66 53.9,30.76 90.93,31.19 92.84,31.19 96.02,26.69 99.66,26.75 99.42,24.33 112.62,28.09 110.9,15.37 78.77,3.48 91.08,1.68 91.62,3.81 19.05,43.18 19.05,34.29 10.16,34.29 10.16,43.18 95.25,58.98 94.72,48.97 113.44,15.37
  pour Top (rank 4): 0,0 124.46,0 124.46,73.66 0,73.66
  pour Bottom (rank 4): 0,0 124.46,0 124.46,73.66 0,73.66
HOST_D+
  Top 0.203: J6.35 62.98,6.88 65.82,9.72 65.82,15.72 67.06,16.95 94.94,16.95 96.25,18.26 J1.35
HOST_D-
  Top 0.203: J6.37 62.48,6.85 65.49,9.86 65.49,15.91 66.87,17.29 94.81,17.29 95.75,18.23 J1.37
I2C_!INT!  (via drill 0.3)
  Top 0.203: J1.16 101,31.92 101.55,32.46 v101.55,35.87 | v28.19,17.27 40.92,17.27 42.27,18.62 42.27,37.01 44.78,39.52 93.02,39.52 v96.22,36.32 | J6.23 66.04,5.08 66.04,2.74 v65.1,1.8 | v27.69,1.52 27.63,1.58 J7.23 27.63,6.66 26.24,8.05 26.24,16.54 v25.4,17.37 v25.4,17.38
  Bottom 0.203: v27.69,1.52 28.7,0.51 64.26,0.51 65.1,1.35 v65.1,1.8 | v101.55,35.87 101.12,36.29 96.24,36.29 v96.22,36.32 | v25.4,17.38 25.51,17.27 v28.19,17.27
I2C_SCL  (via drill 0.3)
  Top 0.203: v98.88,25.04 98.88,24.89 98.53,24.54 98.53,10.89 98.78,10.64 | J4.4 84.84,68.56 J2.4 84.94,63.9 84.94,42.52 85.45,42.01 94.18,42.01 96.16,40.03 v96.14,40.01 | v28.19,6.35 28.19,5.21 J7.21 | J6.21 66.48,6 66.88,6.4 v66.88,6.81 | v76.4,7.39 76.4,7.42 78.18,9.2 97.38,9.2 98.78,10.59 98.78,10.64 | 98.78,10.64 98.91,10.5 R15.1 | v100.33,39.67 100.33,38.76 102.21,36.88 102.21,31.8 101.5,31.09 J1.14 101.5,26.73 101.22,26.44 100.37,26.44 v100.35,26.42
  Bottom 0.203: v98.88,25.04 98.93,25.04 100.31,26.42 v100.35,26.42 | v28.19,6.35 28.25,6.3 35.26,6.3 36.08,7.12 36.08,8.62 38.3,10.85 50.47,10.85 51.05,10.26 51.05,9.7 51.44,9.32 53.7,9.32 54.03,9.65 64.03,9.65 v66.88,6.81 66.98,6.91 75.92,6.91 v76.4,7.39 | v100.33,39.67 100.25,39.75 96.39,39.75 v96.14,40.01
I2C_SCL1-PROCESSOR/QWIIC_EN  (via drill 0.3)
  Top 0.203: R4.1 90.59,54.86 89.79,54.86 89.5,54.57 89.03,54.1 89.03,52.86 U4.3 89.56,52.8 89.92,52.45 89.92,47.37 89.41,46.86 v86.87,46.86 | J1.53 91.75,22.29 v91.72,22.32 | v83.44,29.18 83.44,25.78 84.26,24.96 85.82,24.96 86.9,26.04 v87.38,26.04
  Bottom 0.203: v91.72,22.32 89,25.04 89,25.65 88.67,25.98 87.43,25.98 v87.38,26.04 | v86.87,46.86 84.45,46.86 83.44,45.85 v83.44,29.18
I2C_SDA  (via drill 0.3)
  Top 0.203: v100.33,42.98 86.09,42.98 85.84,43.23 J2.3 85.86,64.02 J4.3 | v67.49,6.38 66.98,5.87 J6.19 66.98,3.94 v67,3.91 | v28.63,3.91 | v28.63,3.91 J7.19 | v101.09,39.67 101.09,39.12 102.92,37.29 102.92,31.4 102,30.48 J1.12 102,26.36 v101.4,25.76 | v76.99,6.5 77.02,6.5 79.01,8.5 98.36,8.5 98.58,8.71 98.58,9.17 99.06,9.65 101,9.65 R14.1 101.85,10.73 101.31,11.28 99.11,11.28 98.86,11.53 98.86,22.23 100.56,23.93 v101.14,23.93
  Bottom 0.203: v67.49,6.38 67.51,6.4 76.89,6.4 v76.99,6.5 | v67,3.91 66.62,4.29 36.93,4.29 35.18,2.54 29.44,2.54 28.63,3.35 v28.63,3.91 | v101.09,39.67 100.33,40.44 v100.33,42.98 | v101.4,25.76 101.4,24.18 v101.14,23.93
I2C_SDA1-PROCESSOR/!SD_ENABLE!  (via drill 0.3)
  Top 0.203: R18.1 94.83,51.64 94.05,50.86 94.05,47.06 92.96,45.97 v87.5,45.97 | J1.51 92.25,22.02 v93.22,22.99 | v84.45,29.97 84.45,27.43 84.65,27.24 86.81,27.24 87.12,26.92 v87.12,26.8
  Bottom 0.203: v93.22,22.99 89.53,26.67 87.25,26.67 v87.12,26.8 | v84.45,29.97 84.45,45.47 84.96,45.97 v87.5,45.97
N$1
  Top 0.203: D4.A 122.72,35.2 122.72,36.73 122.45,37 120.7,37 R5.2
N$2  (via drill 0.3)
  Top 0.203: D8.C 121.86,46.72 121.9,46.76 v122.96,46.76
  Bottom 0.203: v122.96,46.76 122.44,46.24 5V_LED.2
N$3
  Top 0.203: D3.A 121.4,37.73 120.23,38.9 R11.1
N$4
  Top 0.203: J3.B5 112.55,66.68 111.03,65.16 R2.2
N$5  (via drill 0.3)
  Top 0.203: v115.59,66.27 115.55,66.31 J3.A5 | v119.08,65.23 120.03,65.23 R1.2
  Bottom 0.203: v115.59,66.27 118.08,66.27 119.08,65.28 v119.08,65.23
N$6
  Top 0.203: R3.2 114.26,17.27 114.71,16.82 U2.5
N$7  (via drill 0.3)
  Top 0.203: R7.1 113.12,22.1 v112.9,22.1
  Bottom 0.203: v112.9,22.1 114.03,22.1 DIVIDER.2
N$8  (via drill 0.3)
  Top 0.203: v122.94,42.8 122.91,42.83 D2.C
  Bottom 0.203: v122.94,42.8 122.16,42.8 QWIIC_LED.2
N$9
  Top 0.203: D2.A 121.54,40.62 R16.1
N$10  (via drill 0.3)
  Top 0.203: v123.13,39.12 122.36,39.12 D3.C
  Bottom 0.203: v123.13,39.12 v123.12,39.13 3V3_LED.2
N$11  (via drill 0.3)
  Top 0.203: R14.2 104.48,8.8 v104.65,8.64
  Bottom 0.203: I2C_PU.3 103.12,9.63 103.12,8.89 103.38,8.64 v104.65,8.64
N$12
  Top 0.203: D8.A 121.11,45.85 R8.1
N$13  (via drill 0.3)
  Top 0.203: R15.2 99.99,9.14 v99.36,9.14
  Bottom 0.203: v99.36,9.14 99.87,9.65 I2C_PU.1
N$14
  Top 0.203: D4.C 121.96,36.2 119.47,36.2 111.51,28.23 111.51,16.67 111.86,16.32 U2.1
N$16
  Top 0.559: C7.2 100.11,55.88 J10.4 100.11,59.53 99.69,59.94 94.74,59.94 93.98,59.18 93.98,57.15 93.98,55.88 Q2.3
N$18
  Top 0.203: R19.1 R18.2 | R18.2 | Q2.1 93.12,53.01 R18.2
PROCESSOR_CAN-RX
  Top 0.203: J1.41 94.75,18.33 94.26,17.84 66.45,17.84 64.99,16.38 64.99,10.69 61.47,7.17 61.47,7.16 60.91,6.6 60.91,6.12 60.98,6.05 J6.43
PROCESSOR_CAN-TX  (via drill 0.3)
  Top 0.203: v60.79,7.21 60.98,7.21 64.64,10.87 64.64,16.61 66.22,18.19 93.88,18.19 94.25,18.56 J1.43 | v61.47,6.38 61.48,6.36 J6.41
  Bottom 0.203: v60.79,7.21 61.47,6.54 v61.47,6.38
PWM0-PROCESSOR
  Top 0.203: J1.32 97,30.95 96.38,31.57 96.38,34.2 92.22,38.35 49.17,38.35 46.46,35.64 46.46,8.48 47.35,7.59 58.7,7.59 58.98,7.31 J6.51
PWM1-PROCESSOR  (via drill 0.3)
  Top 0.203: J1.47 93.25,19.56 92.39,18.69 65.63,18.69 64.77,19.56 v58.17,19.56 | v23.85,9.83 21.34,9.83 20.63,9.12 J7.51 | v43.84,19.58 43.84,17.07 42.75,15.98 28.14,15.98 27.48,15.32 27.48,9.96 v27.64,9.8
  Bottom 0.203: v23.85,9.83 27.61,9.83 v27.64,9.8 | v43.84,19.58 58.17,19.58 v58.17,19.56
RTS1-PROCESSOR  (via drill 0.3)
  Top 0.203: J1.13 101.75,16.43 v101.8,16.38 | v95.02,16.38 67.94,16.38 67.23,15.67 J6.18
  Bottom 0.203: v95.02,16.38 v101.8,16.38
RX1-DFU_TX-FC0-PLEX
  Top 0.203: J6.4 70.73,10.66 69.96,9.89 67.28,9.89 64.42,7.03 64.42,4.13 62.8,2.52 45.97,2.52 45.54,2.95 45.54,6.17 44.65,7.07 U1.P9
RX1-DFU_TX-FC1-PLEX  (via drill 0.3)
  Top 0.203: J7.4 32.38,9.33 33.5,8.2 36.51,8.2 37.53,7.19 v40.84,7.19 | U1.P8 44.29,6.67 v44.42,6.53
  Bottom 0.203: v44.42,6.53 44.32,6.63 44.32,6.66 41.38,6.66 v40.84,7.19
RX1-PROCESSOR  (via drill 0.3)
  Top 0.203: v100.26,13.4 v100.25,13.41 J1.19 | U1.P6 43.23,5.44 43.36,5.32 43.36,2.74 44.02,2.08 63.52,2.08 65.08,3.63 65.08,6.48 67.27,8.67 71.77,8.67 75.74,12.64 94.01,12.64 94.7,13.33 v94.79,13.33 v94.8,13.34
  Bottom 0.203: v100.26,13.4 94.87,13.4 v94.81,13.34 v94.8,13.34
RX1-PROCESSOR-PLEX  (via drill 0.3)
  Top 0.203: J6.13 68.48,2.95 66.47,0.94 41.35,0.94 40.77,1.52 40.77,5.79 v41.12,6.15 | v44.09,5.86 44.09,5.98 43.81,6.26 U1.P7
  Bottom 0.203: v44.09,5.86 43.81,6.15 v41.12,6.15
RX2-PROCESSOR  (via drill 0.3)
  Top 0.203: J7.13 30.13,6.55 27,9.68 27,17.42 27.94,18.36 40.31,18.36 41.53,19.58 41.53,37.49 44.15,40.11 93.4,40.11 v96.22,37.29 | v100.03,37.26 100,37.23 J1.20
  Bottom 0.203: v100.03,37.26 96.75,37.26 96.72,37.29 v96.22,37.29
SDIO_DATA1/PWR_EN1_ALT  (via drill 0.3)
  Top 0.203: v83.31,14.83 83.29,14.81 v83.29,13.34 | J7.71 15.63,7.49 15.34,7.77 11.56,7.77 10.54,8.79 10.54,19.36 17.09,25.91 v39.71,25.91 | v52.65,25.96 52.65,30.48 53.65,31.48 86.9,31.48 88.5,29.88 J1.66 88.5,24.95 87.79,24.23 v86.74,24.23 | S7.3 79.79,5.96 79.99,6.16 v83.33,6.16 v83.33,6.15
  Bottom 0.203: v86.74,24.23 86.51,24.23 83.31,21.03 v83.31,14.83 | v52.65,25.96 39.76,25.96 v39.71,25.91 | v83.29,13.34 83.36,13.26 83.36,6.18 v83.33,6.15
SDIO_DATA2/PWR_EN0_ALT  (via drill 0.3)
  Top 0.203: v87.91,25.17 88,25.27 J1.68 | v84.84,14.83 v84.84,13.34 | J6.71 53.95,5.11 53.95,3.83 v54,3.79 | v69.39,1.91 69.65,1.65 88.62,1.65 v88.65,1.68 | 88.68,5.08 S3.3 | v85.09,5.21 85.22,5.08 88.68,5.08 | 88.68,5.08 89.42,5.08 v89.48,5.14
  Bottom 0.203: v87.91,25.17 87.86,25.17 87.25,24.56 87.25,23.8 84.84,21.39 v84.84,14.83 | v69.39,1.91 67.84,1.91 65.89,3.86 54.08,3.86 v54,3.79 | v84.84,13.34 84.81,13.31 84.81,5.49 v85.09,5.21 | v88.65,1.68 88.7,1.73 88.7,4.87 88.91,5.08 89.42,5.08 v89.48,5.14
SHLD
  pour Bottom (isolate 0.305, no thermals): 109.73,67.31 118.36,67.31 118.36,72.69 109.73,72.69
  pour Top (isolate 0.305, no thermals): 109.73,67.31 118.62,67.31 118.62,72.69 109.73,72.69
SPI_PROCESSOR_SCK  (via drill 0.3)
  Top 0.203: 91.8,23.32 92.48,24 96.27,24 97.16,23.11 97.16,12.32 96.09,11.25 76.02,11.25 73.84,9.07 73.84,4.19 73.2,3.56 71.35,3.56 70.98,3.92 J6.3 70.98,7.44 v71.37,7.83 | v90.47,24.54 90.44,24.57 91.52,25.65 96.77,25.65 97.79,26.67 97.79,31.75 97.41,32.13 97.41,41.27 98.03,41.9 101.57,41.9 103.86,44.19 103.86,53.11 101.21,55.76 J10.5 | v31.32,9.75 31.32,9.28 32.63,7.97 J7.3 | 91.8,23.32 v92.21,22.9 | J1.57 90.75,21.87 90.77,21.89 90.77,22.29 91.8,23.32
  Bottom 0.203: v71.37,7.83 71.3,7.91 71.3,11.13 70.82,11.61 54.84,11.61 53.26,13.18 31.98,13.18 31.32,12.52 v31.32,9.75 | v92.21,22.9 90.58,24.54 v90.47,24.54
SPI_PROCESSOR_SDI  (via drill 0.3)
  Top 0.203: J1.61 89.75,22.94 91.94,25.13 97.27,25.13 97.66,25.53 | 97.66,25.53 98.2,26.06 98.2,40.79 98.69,41.28 101.97,41.28 104.63,43.93 104.63,55.02 103.41,56.24 J10.7 | 97.66,25.53 98.16,25.04 98.16,11.53 96.56,9.93 76.55,9.93 75.34,8.72 75.34,3.35 74.27,2.29 70.87,2.29 69.98,3.17 J6.7 69.98,7.44 v69.67,7.75 | J7.7 31.62,6.91 v31.34,7.19
  Bottom 0.203: v69.67,7.75 69.67,9.83 69.19,10.31 53.86,10.31 52.58,11.6 37.96,11.6 34.87,8.51 32.66,8.51 v31.34,7.19
SPI_PROCESSOR_SDO  (via drill 0.3)
  Top 0.203: J1.59 90.23,20.91 90.23,22.1 | 90.23,22.1 90.23,22.61 92.25,24.63 96.98,24.63 97.66,23.96 97.66,11.71 96.49,10.55 76.04,10.55 74.65,9.16 74.65,3.79 73.76,2.9 71.09,2.9 70.48,3.51 J6.5 70.48,7.74 v70.51,7.77 | v31.06,8.26 32.13,7.19 J7.5 | J10.3 99.01,53.54 103.02,49.53 103.02,44.79 100.68,42.44 97.65,42.44 96.83,41.62 96.83,31.87 97.41,31.28 97.41,27.18 96.33,26.1 91.17,26.1 89.15,24.09 v89.15,22.1 | 90.23,22.1 v90.26,22.1
  Bottom 0.203: v70.51,7.77 70.51,10.58 70.17,10.92 54.27,10.92 52.74,12.45 37.29,12.45 34.29,9.45 32.36,9.45 31.17,8.26 v31.06,8.26 | v89.15,22.1 v90.26,22.1
SPI_SCK1-PROCESSOR  (via drill 0.3)
  Top 0.203: J1.60 90,31.66 87.89,33.77 52.59,33.77 50.55,31.73 v50.55,26.92 | v39.71,26.92 15.82,26.92 9.17,20.27 9.17,5.38 11.25,3.3 17.78,3.3 18.13,3.65 J7.61
  Bottom 0.203: v50.55,26.92 v39.71,26.92
SPI_SDO1-PROCESSOR  (via drill 0.3)
  Top 0.203: J7.59 18.63,3.39 17.75,2.52 9.97,2.52 7.64,4.84 7.64,20.74 14.75,27.84 v39.71,27.84 | v51.56,27.89 51.56,31.01 53.44,32.89 86.99,32.89 89.5,30.38 J1.62
  Bottom 0.203: v39.71,27.84 39.76,27.89 v51.56,27.89
SWDCK  (via drill 0.3)
  Top 0.203: J1.21 99.75,12.77 100.33,12.19 v105.41,12.19 | v117.6,12.45 118.36,13.21 118.36,16.84 119.05,17.53 122.38,17.53 122.94,16.97 122.94,14.35 122.55,13.96 J5.4
  Bottom 0.203: v105.41,12.19 117.35,12.19 v117.6,12.45
SWDIO  (via drill 0.3)
  Top 0.203: J1.23 99.25,12.25 99.82,11.68 v104.78,11.68 | v117.86,11.68 118.87,12.7 118.87,16.51 119.38,17.02 121.67,17.02 121.98,16.7 J5.2
  Bottom 0.203: J5.2 121.98,17.77 TP1.1 | v104.78,11.68 v117.86,11.68
TX1-DFU_RX-FC0-PLEX  (via drill 0.3)
  Top 0.203: v44.53,7.67 45.03,7.67 46.15,6.55 46.15,3.31 46.62,2.85 62.66,2.85 64.08,4.27 64.08,7.19 67.16,10.26 69.85,10.26 70.23,10.64 J6.6 | U1.P1 41.7,7.07 v41.55,7.21
  Bottom 0.203: v41.55,7.21 41.66,7.11 43.97,7.11 v44.53,7.67
TX1-DFU_RX-FC1-PLEX
  Top 0.203: J7.6 31.88,9.22 33.22,7.87 36.37,7.87 37.58,6.67 U1.P2
TX1-PROCESSOR  (via drill 0.3)
  Top 0.203: v100.75,12.83 100.75,12.93 100.78,12.96 100.78,20.86 J1.17 | v95.78,12.74 94.97,11.93 75.88,11.93 72.3,8.34 67.41,8.34 65.41,6.34 65.41,3.47 63.66,1.73 43.15,1.73 42.34,2.53 42.34,5.31 42.43,5.4 U1.P4
  Bottom 0.203: v100.75,12.83 95.87,12.83 v95.78,12.74
TX1-PROCESSOR-PLEX
  Top 0.203: J6.15 67.97,5.13 67.97,2.9 66.33,1.27 42.27,1.27 41.6,1.93 41.6,5.91 41.96,6.26 U1.P3
TX2-PROCESSOR  (via drill 0.3)
  Top 0.203: J1.22 99.5,38.01 v99.67,38.18 | J7.15 29.63,6.04 26.67,8.99 26.67,18.34 27.48,19.15 39.52,19.15 40.69,20.32 40.69,38.3 43.1,40.72 93.69,40.72 v96.22,38.19
  Bottom 0.203: v99.67,38.18 99.63,38.21 96.24,38.21 v96.22,38.19
V_BATT  (via drill 0.3)
  Top 0.559: Q1.3 110.74,56.13 108.81,54.2 108.81,31.55 109.32,31.04 109.32,15.27 110.17,14.42 U2.3 112.11,13.28 C4.1 113.28,12.1 113.28,8.13 114.05,7.37 114.05,6.35 | 114.05,6.35 114.05,6.1 113.3,5.35 J8.2 107.33,5.35 J11.2 | v115.62,6.35 114.05,6.35
  Bottom 0.559: TP3.1 v115.62,6.35
V_USB  (via drill 0.3)
  Top 0.203: U3.5 v113,63.25
  Top 0.254: J3.VBUS2 111.85,67.55 112.98,68.68 115.62,68.68 116.75,67.55 J3.VBUS1
  Top 0.559: F2.1 117.35,63.99 116.75,64.58 J3.VBUS1
  Bottom 0.203: v117.42,63.04 117.22,63.25 v113,63.25
  Bottom 0.559: BYP.1 v117.42,63.04
  pour Top (isolate 0.305, no thermals): 116.96,63.55 116.97,63.53 116.97,62.89 117.86,62.89 117.86,63.53 117.87,63.55 117.88,63.57 117.91,63.58 118.87,63.58 118.87,64.8 115.82,64.8 115.82,63.58 116.92,63.58 116.94,63.57
VCC  (via drill 0.3)
  Top 0.203: v90.68,50.29 R4.2
  Top 0.559: D5.C 112.15,55 110.49,53.34 v110.49,50.29 110.49,31.86 110.52,31.83 v110.52,17.09 | v87.43,50.29 v86.72,50.29 86.72,50.99 C2.1 87.19,51.46 U4.1
  Bottom 0.559: v110.49,50.29 v90.68,50.29 v87.43,50.29 | v14.71,14.17 v15.32,14.17 16.15,15.01 52.27,15.01 53.21,14.07 v53.26,14.07 v53.87,14.07 53.9,14.1 107.52,14.1 v110.52,17.09
  pour Top (no thermals): 53.58,13.69 53.59,13.67 53.59,11.94 53.85,11.94 53.85,13.67 53.86,13.69 53.88,13.71 53.9,13.72 54.1,13.72 54.1,14.68 52.93,14.68 52.93,13.72 53.04,13.72 53.06,13.71 53.08,13.69 53.09,13.67 53.09,11.94 53.34,11.94 53.34,13.67 53.35,13.69 53.37,13.71 53.39,13.72 53.54,13.72 53.57,13.71
  pour Top (no thermals): 15.23,13.69 15.24,13.67 15.24,11.94 15.49,11.94 15.49,13.67 15.5,13.69 15.52,13.71 15.54,13.72 15.6,13.72 15.6,14.76 14.38,14.76 14.38,13.72 14.68,13.72 14.7,13.71 14.72,13.69 14.73,13.67 14.73,11.94 14.99,11.94 14.99,13.67 15,13.69 15.01,13.71 15.04,13.72 15.19,13.72 15.21,13.71
  pour Top (no thermals): 114.55,49.91 115.19,49.91 115.7,50.42 115.7,54.36 116.08,54.74 116.84,54.74 117.86,54.74 117.86,55.63 114.05,55.63 114.05,50.42
VIN  (via drill 0.3)
  Top 0.178: R5.1 117.47,37.47 v116.84,36.83
  Top 0.203: R6.2 119.01,61.24 F2.2 | Q1.1 119.95,57.08 120.65,56.39 120.65,55.2 118.62,53.17 118.62,45.94 R8.2
  Top 0.254: J1.9 102.75,19.29 103.38,18.67
  Top 0.559: 103.38,18.67 105.97,18.67 v107.15,19.85 107.11,19.89 v107.11,38.1 107.11,54.65 111.76,59.3 D5.A | D5.A 114.81,60.96 115.09,61.24 F2.2 | Q1.1 117.36,58.66 116.72,59.3 D5.A | R10.2 v115.57,19.43 115.82,19.18 115.82,15.24 115.82,14.86 115.82,14.67 | C3.1 116.81,14.42 116.08,14.42 | U2.4 115.57,14.42 | 115.57,14.42 116.08,14.42 | 115.82,14.67 115.57,14.42 | 115.82,14.67 116.08,14.42
  Bottom 0.178: v116.84,36.83 115.57,38.1 v107.11,38.1
  Bottom 0.559: v117.35,62.23 BYP.2 TP4.1 | v115.57,19.43 115.06,19.94 107.11,19.94 107.2,19.85 v107.15,19.85
  pour Top (isolate 0.305, no thermals): 116.86,61.57 116.84,61.55 116.81,61.54 115.85,61.54 115.85,60.58 118.85,60.58 118.85,61.54 118.01,61.54 117.99,61.55 117.97,61.57 117.96,61.6 117.96,62.46 116.87,62.46 116.87,61.6
VIN/3  (via drill 0.3)
  Top 0.203: J1.49 92.75,21.84 93.19,22.28 v94.18,22.28 | R10.1 R7.2 112.56,21.55 v112.01,22.1
  Bottom 0.203: v94.18,22.28 94.44,22.28 94.61,22.1 v112.01,22.1

## Text on the board
Bottom: v21
tPlace: - | +
Measures: Units in Inches
tDocu: Elias Santistevan